# EAGLE design EXT_RS485 (EAGLE 7.7.0)
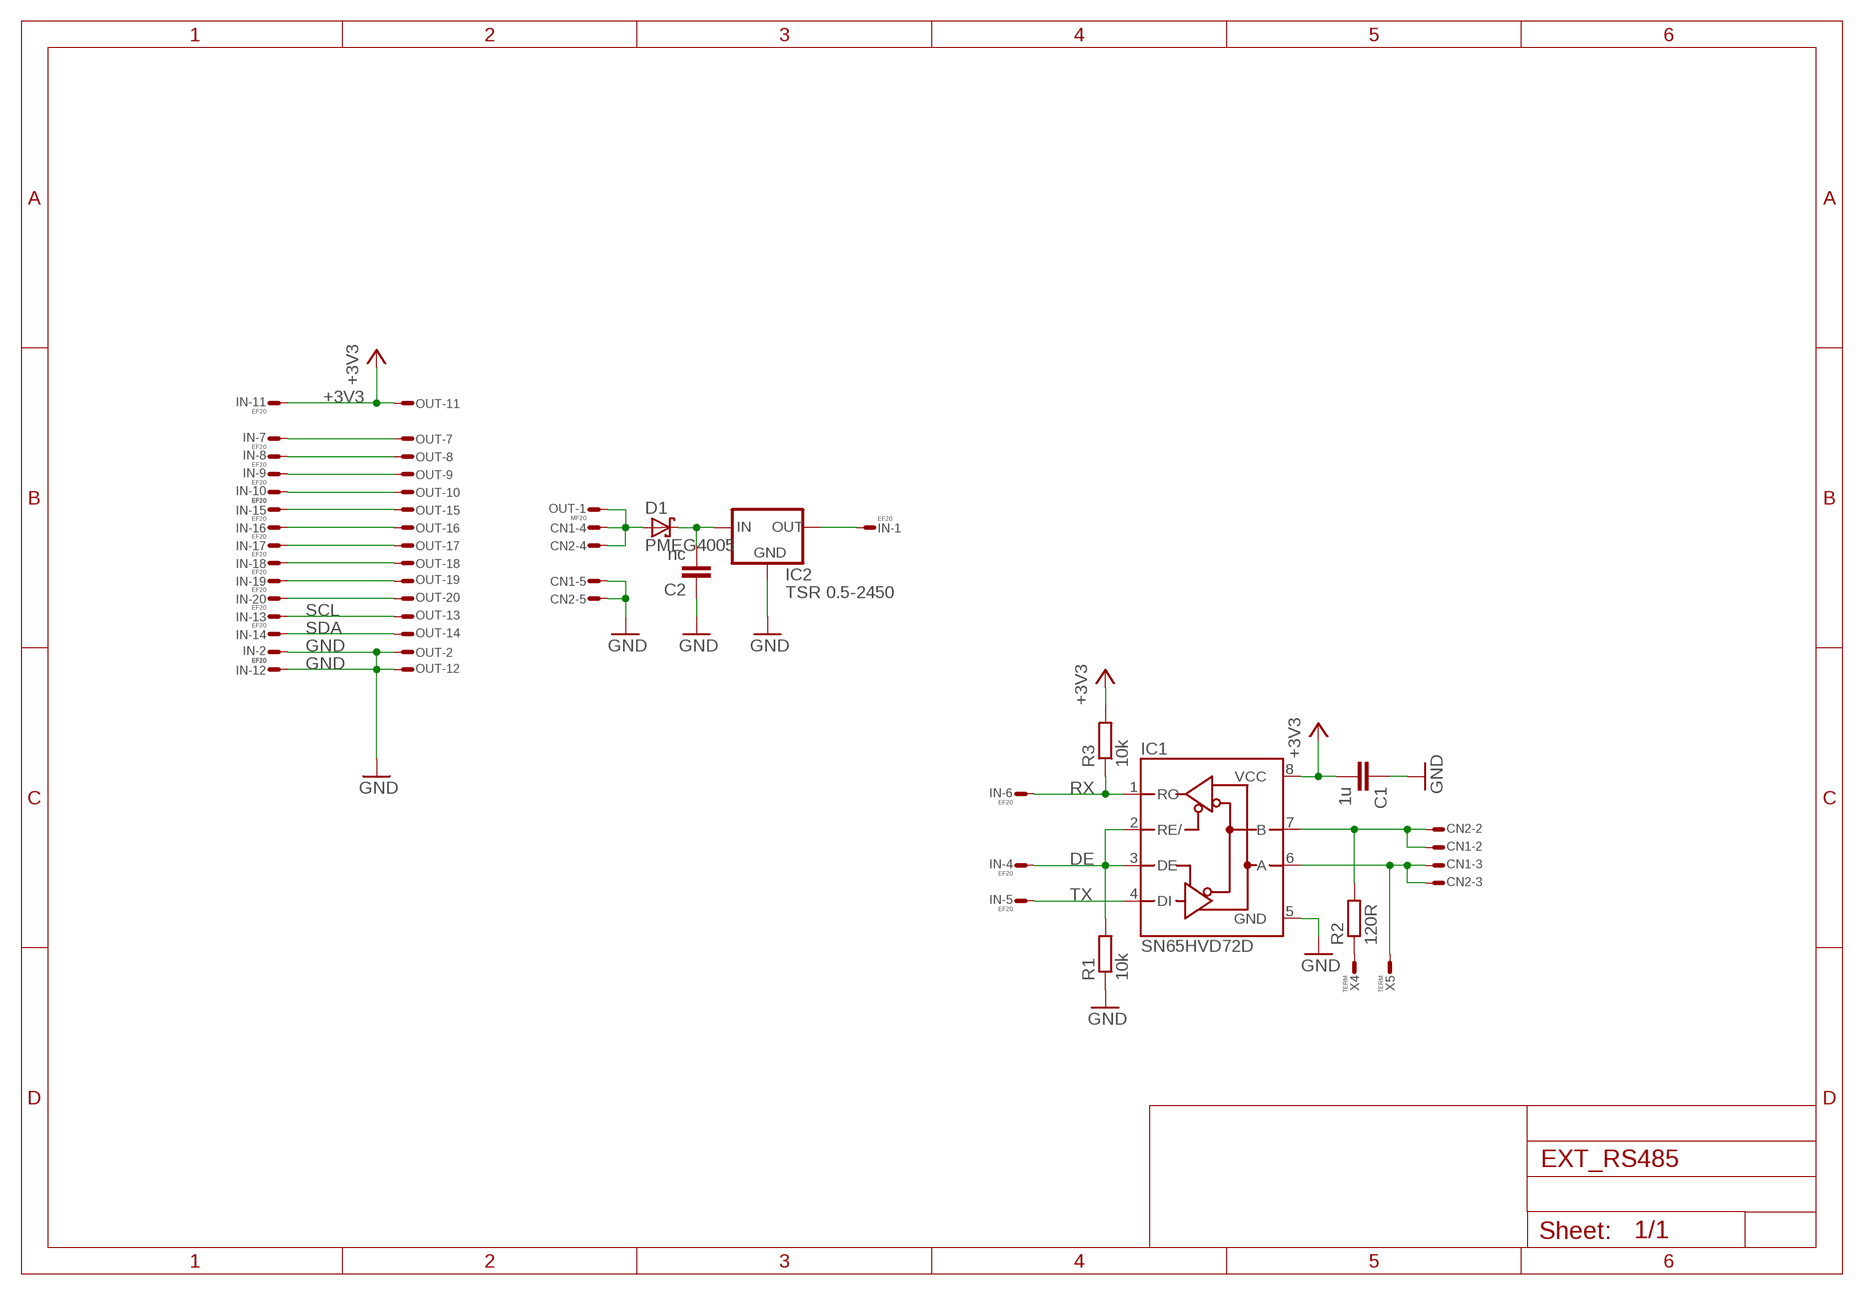
[diagram p0: schematic, sheet 1]

## Parts
C1  1u  C0603  [0603]
C2  nc  C1206  [1206]
CN1  RJ11  CON6RJ11V  [69254]
CN2  RJ11  CON6RJ11V  [69254]
D1  PMEG4005  D-SCHOTKY323  [SOD323]
IC1  SN65HVD72D  MAX485  [SOIC8]
IC2  TSR 0.5-2450  78XXS3  [SIP3]
IN  EF20  FE20ELSS  [FE10-2WSS]
OUT  MF20  ML20LSE  [ML20LS]
R1  10k  R0603  [0603]
R2  120R  R0603  [0603]
R3  10k  R0603  [0603]
X4  TERM  WIREPADT1.6/0.9  [T1.6/0.9]
X5  TERM  WIREPADT1.6/0.9  [T1.6/0.9]

## Nets
+3V3: C1.2 IC1.8(VCC) IN.P$11 OUT.P$11 R3.2
BUS-A: CN1.-3 CN2.-3 IC1.6(A) X5.1(S)
BUS-B: CN1.-2 CN2.-2 IC1.7(B) R2.2
BUS-R: R2.1 X4.1(S)
DE: IC1.2(RE/) IC1.3(DE) IN.P$4 R1.2
GND: C1.1 C2.1 CN1.-5 CN2.-5 IC1.5(GND) IC2.P$2(GND) IN.P$2 IN.P$12 OUT.P$2 OUT.P$12 R1.1
N$1: IN.P$7 OUT.P$7
N$2: IN.P$8 OUT.P$8
N$3: IN.P$9 OUT.P$9
N$4: IN.P$10 OUT.P$10
N$5: IN.P$20 OUT.P$20
N$6: IN.P$19 OUT.P$19
N$7: IN.P$18 OUT.P$18
N$8: IN.P$17 OUT.P$17
N$9: IN.P$16 OUT.P$16
N$10: IN.P$15 OUT.P$15
N$11: C2.2 D1.C IC2.P$1(IN)
RX: IC1.1(RO) IN.P$6 R3.1
SCL: IN.P$13 OUT.P$13
SDA: IN.P$14 OUT.P$14
TX: IC1.4(DI) IN.P$5
VIN: CN1.-4 CN2.-4 D1.A OUT.P$1
VOUT: IC2.P$3(OUT) IN.P$1
Unconnected: CN1.-1 CN1.-6 CN2.-1 CN2.-6 IN.P$3 OUT.P$3 OUT.P$4 OUT.P$5 OUT.P$6

## Library data of the parts
C1 C2 = RCL:C: Capacitor SMD
CN1 CN2 = Conn:CON6
D1 = Diode:D-SCHOTKY: Schottky Diode
IC1 = ICs:MAX485
IC2 = DCDC:78XX: Voltage Regulator
IN = Conn:FE20E
OUT = Conn:ML20?E: HARTING
R1-R3 = RCL:R: Resistor SMD
X4 X5 = Conn:WIREPAD: Wire PAD connect wire on PCB

## Board
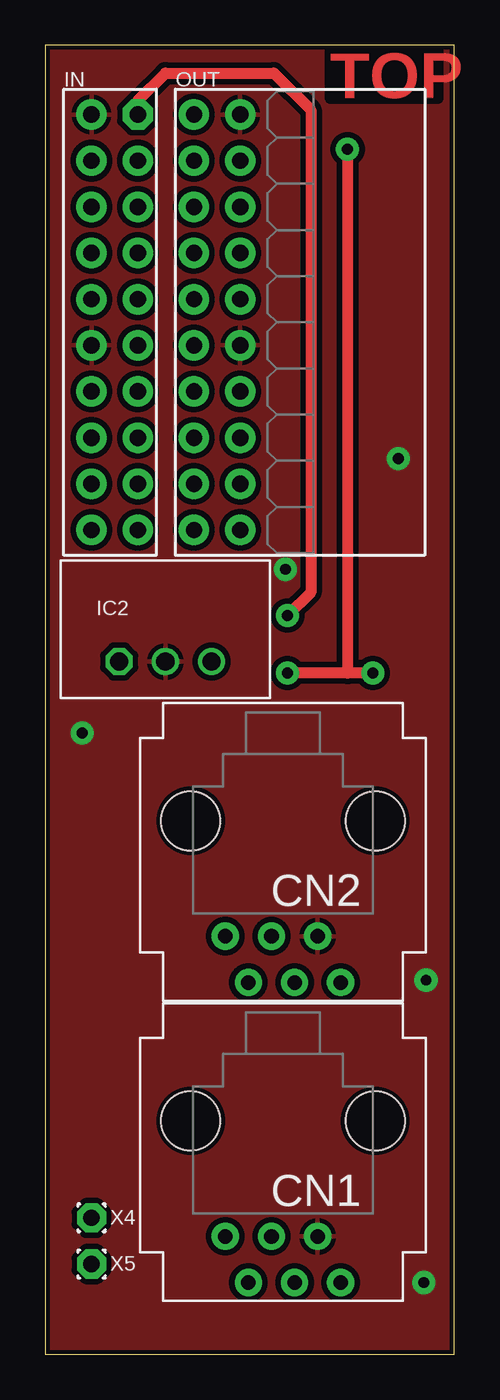
[diagram p1: board, top side]
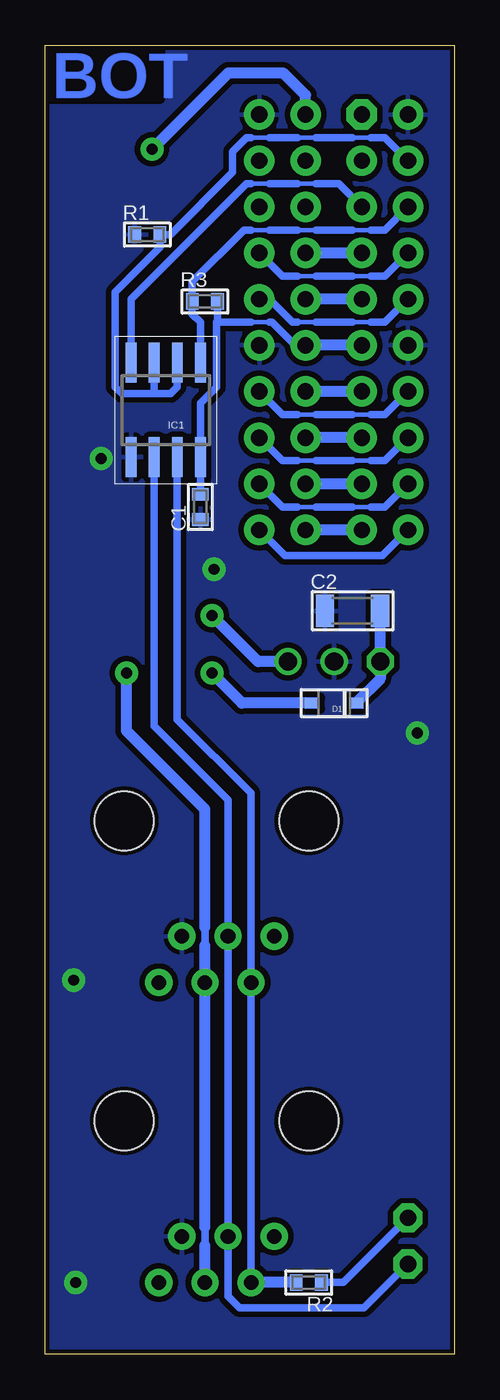
[diagram p2: board, bottom side, seen from below]

Size 22.5 x 72 mm. Coordinates in mm from the lower left corner, seen from the top.
Outline: 0,0 22.5,0 22.5,72 0,72 0,0
Copper layers (1*16): Top 0.035mm / dielectric 0.2mm / Bottom 0.035mm
Design rules "SeeedStudio_DRU_no_angle_20130527 *": minimum track width 6mil, minimum drill 12mil, track to track 12mil, track to pad 12mil, pad to pad 12mil, via to via 12mil, smd to smd 8mil, copper to edge 10mil, drill to drill 10mil, minimum pad ring 6mil, minimum via ring 6mil, stop-mask expansion 2mil, vias tented up to drill 25mil, thermal gap 10mil
tKeepout: area 0,0 to 22.5,2; area 0,70 to 22.5,72
bRestrict: area 14.4,48 to 14.9,48.1

### Footprints (pad centres in the part's own frame; a part is rotated, then mirrored left to right if it is on the bottom)
0603 = smd 0.7 x 0.9: 1 -0.697,0; 2 0.697,0
1206 = smd 1.016 x 1.778: 1 -1.524,0; 2 1.524,0
69254 = drill 0.8 pad 1.5: -1 3.175,6.35; -2 1.905,8.89; -3 0.635,6.35; -4 -0.635,8.89; -5 -1.905,6.35; -6 -3.175,8.89 | hole 3.25: 5.08,0; -5.08,0
SOD323 = smd 0.8 x 0.6: A 1.2,0; C -1.2,0
SOIC8 = smd 0.6 x 2.2: 1 -1.905,-2.6; 2 -0.635,-2.6; 3 0.635,-2.6; 4 1.905,-2.6; 5 1.905,2.6; 6 0.635,2.6; 7 -0.635,2.6; 8 -1.905,2.6
SIP3 = drill 1 octagon: P$1 -2.54,-2.54 | drill 1: P$2 0,-2.54; P$3 2.54,-2.54
FE10-2WSS = drill 0.9 pad 1.676 octagon: P$1 -11.43,1.27 | drill 0.9 pad 1.676: P$2 -11.43,-1.27; P$3 -8.89,1.27; P$4 -8.89,-1.27; P$5 -6.35,1.27; P$6 -6.35,-1.27; P$7 -3.81,1.27; P$8 -3.81,-1.27; P$9 -1.27,1.27; P$10 -1.27,-1.27; P$11 1.27,1.27; P$12 1.27,-1.27; P$13 3.81,1.27; P$14 3.81,-1.27; P$15 6.35,1.27; P$16 6.35,-1.27; P$17 8.89,1.27; P$18 8.89,-1.27; P$19 11.43,1.27; P$20 11.43,-1.27
ML20LS = drill 0.9 pad 1.676: P$1 -11.43,-1.27; P$2 -11.43,1.27; P$3 -8.89,-1.27; P$4 -8.89,1.27; P$5 -6.35,-1.27; P$6 -6.35,1.27; P$7 -3.81,-1.27; P$8 -3.81,1.27; P$9 -1.27,-1.27; P$10 -1.27,1.27; P$11 1.27,-1.27; P$12 1.27,1.27; P$13 3.81,-1.27; P$14 3.81,1.27; P$15 6.35,-1.27; P$16 6.35,1.27; P$17 8.89,-1.27; P$18 8.89,1.27; P$19 11.43,-1.27; P$20 11.43,1.27
T1.6/0.9 = drill 0.9 pad 1.6 octagon: 1 0,0

### Placement (x,y rotation side)
C1  13.97,46.61 90 bottom
C2  5.59,40.89 0 bottom
CN1  13.08,12.83 180 top
CN2  13.08,29.34 180 top
D1  6.6,35.81 180 bottom
IC1  15.88,51.94 180 bottom
IC2  6.6,40.64 0 top
IN  3.81,56.77 270 top
OUT  9.45,56.77 270 top
R1  16.89,61.59 0 bottom
R2  8,3.94 180 bottom
R3  13.72,57.91 0 bottom
X4  2.54,7.49 0 top
X5  2.54,4.95 0 top

### Tracks (layer width: path | path; a pad name or v marks a point on that pad's centre or on a via)
+3V3
  Bottom 0.254: 11.18,56.77 10.16,56.77
  Bottom 0.406: OUT.P$11 8.76,55.5 10.03,56.77 10.16,56.77 | C1.2 IC1.8 13.97,52.32 13.08,53.21 13.08,56.77 | 13.08,56.77 11.18,56.77 | R3.2 13.02,56.83 13.08,56.77
  Bottom 0.61: IN.P$11 OUT.P$11
BUS-A
  Bottom 0.406: X5.1 4.95,2.54 11.81,2.54 12.45,3.17 CN1.-3 CN2.-3 12.45,30.48 16.51,34.54 IC1.6
BUS-B
  Bottom 0.406: CN1.-2 CN2.-2 11.18,30.86 15.24,34.92 IC1.7
  Bottom 0.61: R2.2 CN1.-2
BUS-R
  Bottom 0.406: R2.1 6.1,3.94 X4.1
DE
  Bottom 0.254: 4.57,66.93 5.59,66.93 | 7.62,66.93 8.64,66.93 | 10.16,66.93 11.18,66.93
  Bottom 0.406: IN.P$4 3.81,66.93 4.57,66.93 | 5.59,66.93 7.62,66.93 | 8.64,66.93 10.16,66.93 | 11.18,66.93 11.43,66.93 12.19,66.17 12.19,65.02 15.62,61.59 R1.2 16.19,60.9 18.67,58.42 18.67,53.21 18.29,52.83 16.51,52.83 | IC1.2 15.24,53.21 15.62,52.83 16.51,52.83 | IC1.3 16.51,52.83
GND  (via drill 0.6 pad 1.27)
  other vias: 19.43,49.28 13.21,43.18 2.03,34.16 20.95,20.57 20.83,3.94
  pour Bottom: 0,0 22.5,0 22.5,72 0,72
  pour Top: 0,0 22.5,0 22.5,72 0,72
N$1
  Bottom 0.61: IN.P$7 OUT.P$7
N$2
  Bottom 0.254: 4.57,59.31 5.59,59.31 | 7.62,59.31 8.64,59.31
  Bottom 0.406: IN.P$8 3.81,59.31 4.57,59.31 | OUT.P$8 9.45,59.31 8.64,59.31 | 5.59,59.31 7.62,59.31
N$3
  Bottom 0.61: IN.P$9 OUT.P$9
N$4
  Bottom 0.254: 4.57,56.77 5.59,56.77 | 7.62,56.77 8.64,56.77
  Bottom 0.406: IN.P$10 3.81,56.77 4.57,56.77 | OUT.P$10 10.16,58.04 8.89,56.77 8.64,56.77 | 5.59,56.77 7.62,56.77
N$5
  Bottom 0.406: IN.P$20 3.94,43.94 9.32,43.94 OUT.P$20
N$6
  Bottom 0.61: IN.P$19 OUT.P$19
N$7
  Bottom 0.254: 4.57,46.61 5.59,46.61 | 7.62,46.61 8.64,46.61
  Bottom 0.406: IN.P$18 3.81,46.61 4.57,46.61 | OUT.P$18 9.45,46.61 8.64,46.61 | 5.59,46.61 7.62,46.61
N$8
  Bottom 0.61: IN.P$17 OUT.P$17
N$9
  Bottom 0.254: 4.57,49.15 5.59,49.15 | 7.62,49.15 8.64,49.15
  Bottom 0.406: IN.P$16 3.81,49.15 4.57,49.15 | OUT.P$16 9.45,49.15 8.64,49.15 | 5.59,49.15 7.62,49.15
N$10
  Bottom 0.61: IN.P$15 OUT.P$15
N$11
  Bottom 0.61: D1.C 4.06,37.15 IC2.P$1 C2.2
RX
  Bottom 0.254: 4.57,61.85 5.59,61.85 | 7.62,61.85 8.64,61.85 | 10.16,61.85 11.18,61.85
  Bottom 0.406: IN.P$6 3.81,61.85 4.57,61.85 | 5.59,61.85 7.62,61.85 | 8.64,61.85 10.16,61.85 | 11.18,61.85 11.56,61.85 14.41,58.99 R3.1 14.41,57.21 13.97,56.77 IC1.1
SCL
  Bottom 0.61: IN.P$13 OUT.P$13
SDA
  Bottom 0.254: 4.57,51.69 5.59,51.69 | 7.62,51.69 8.64,51.69
  Bottom 0.406: IN.P$14 3.81,51.69 4.57,51.69 | OUT.P$14 9.45,51.69 8.64,51.69 | 5.59,51.69 7.62,51.69
TX
  Bottom 0.254: 7.62,64.39 8.64,64.39 | 10.16,64.39 11.18,64.39
  Bottom 0.406: IN.P$5 6.35,64.39 7.62,64.39 | 8.64,64.39 10.16,64.39 | 11.18,64.39 11.43,64.39 17.78,58.04 IC1.4
VIN  (via drill 0.6 pad 1.27)
  Top 0.61: v18.03,37.47 16.64,37.47 | 16.64,37.47 v13.34,37.47 | v16.64,66.29 16.64,37.47
  Bottom 0.406: 13.72,5.97 13.72,6.99 | 13.72,22.48 13.72,23.5
  Bottom 0.61: v18.03,37.47 18.03,34.29 13.72,29.97 13.72,23.5 | OUT.P$1 8.18,69.27 9.4,70.48 12.45,70.48 v16.64,66.29 | CN1.-4 13.72,5.97 | 13.72,6.99 CN2.-4 13.72,22.48 | v13.34,37.47 11.68,35.81 D1.A
VOUT  (via drill 0.6 pad 1.27)
  Top 0.61: IN.P$1 5.08,68.96 6.6,70.48 12.57,70.48 14.61,68.45 14.61,41.91 v13.34,40.64
  Bottom 0.61: IC2.P$3 10.79,38.1 v13.34,40.64

### Text on the board
Top: TOP
Bottom: BOT